# EAGLE design Grove  4-Digit Display V1.0 (EAGLE 6.1)
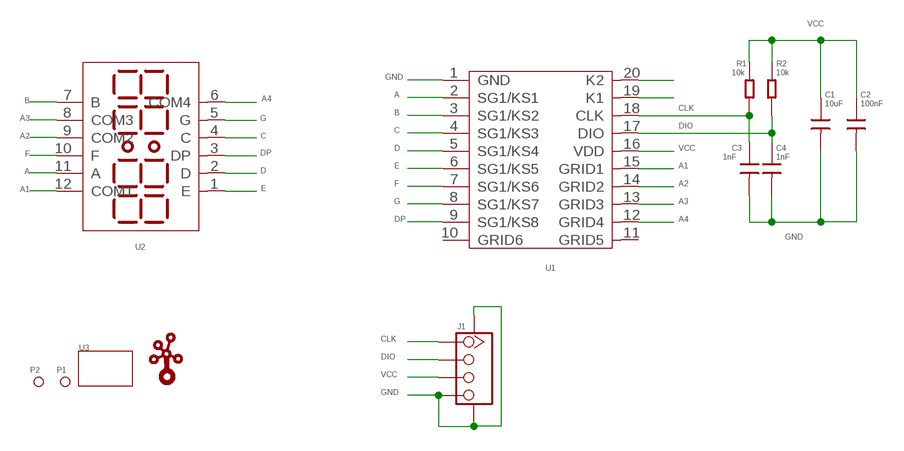
[diagram p0: schematic, sheet 1]

## Parts
C1  10uF  C-0603  [0603]
C2  100nF  C-0603  [0603]
C3  1nF  C-0603  [0603]
C4  1nF  C-0603  [0603]
J1  TWIG-4P-2.0-SMD-FEMALE-REINFORCE'90D'  [4P-SMD-2.0-90D]
P1  PAD-MARK  [ROUND-MARK-0.635]
P2  PAD-MARK  [ROUND-MARK-0.635]
R1  10k  R-0603  [0603]
R2  10k  R-0603  [0603]
U1  TM1637  [SOP20-10.45]
U2  LED-4-BETY-7-SEG  [7-4-BYTE-SEG-2.54-30X14X7.3H]
U3  TWIG-2U  [2U-DIM-W/-DRILL]
U$1  LOGO-TWIGTWIGLOGO_SMALL  [TWIGLOGO_SMALL]

## Nets
A: U1.2(SG1/KS1) U2.11(A)
A1: U1.15(GRID1) U2.12(COM1)
A2: U1.14(GRID2) U2.9(COM2)
A3: U1.13(GRID3) U2.8(COM3)
A4: U1.12(GRID4) U2.6(COM4)
B: U1.3(SG1/KS2) U2.7(B)
C: U1.4(SG1/KS3) U2.4(C)
CLK: C3.1 J1.1 R1.2 U1.18(CLK)
D: U1.5(SG1/KS4) U2.2(D)
DIO: C4.1 J1.2 R2.2 U1.17(DIO)
DP: U1.9(SG1/KS8) U2.3(DP)
E: U1.6(SG1/KS5) U2.1(E)
F: U1.7(SG1/KS6) U2.10(F)
G: U1.8(SG1/KS7) U2.5(G)
GND: C1.2 C2.2 C3.2 C4.2 J1.4 J1.SS1 J1.SS2 U1.1(GND)
N$17: U1.19(K1)
N$18: U1.20(K2)
VCC: C1.1 C2.1 J1.3 R1.1 R2.1 U1.16(VDD)
Unconnected: U1.10(GRID6) U1.11(GRID5)

## Library data of the parts
C1-C4 = Discrete:C*: Ceramic Capacitors
J1 = Connector:TWIG-4P-2.0-SMD-FEMALE-REINFORCE
P1 P2 = Discrete:PAD-MARK
R1 R2 = Discrete:R*
U1 = IC:TM1637
U2 = Module:LED-4-BETY-7-SEG
U3 = Module:TWIG
U$1 = Logo:LOGO-TWIG

## Board
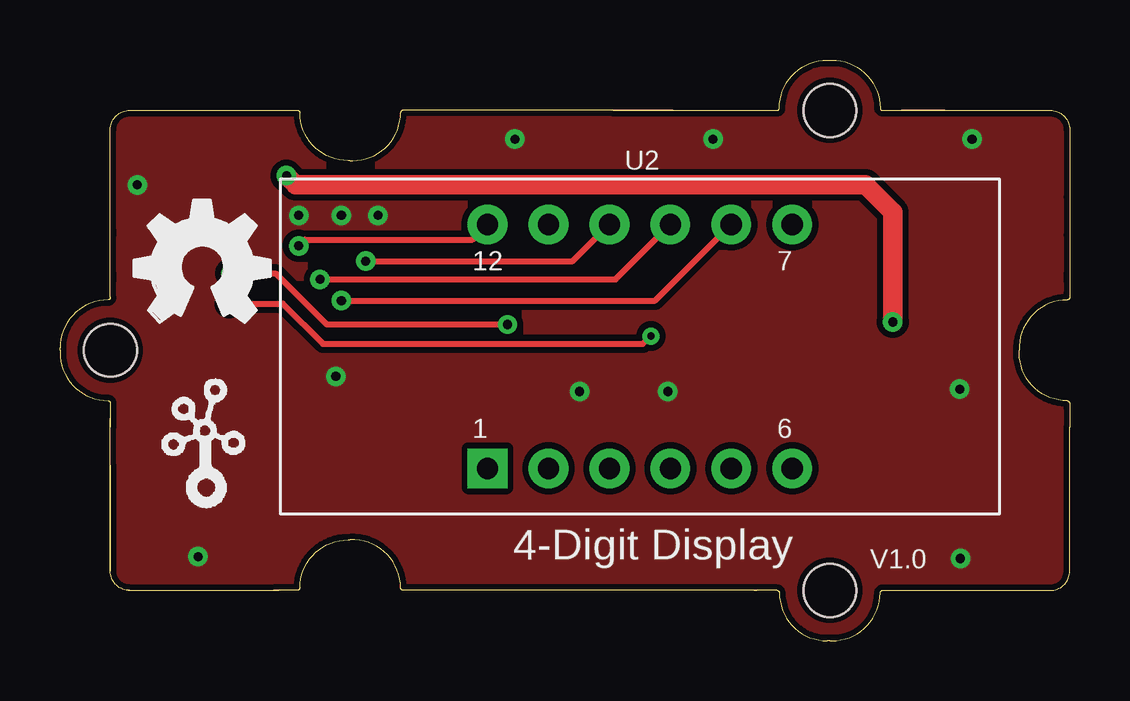
[diagram p1: board, top side]
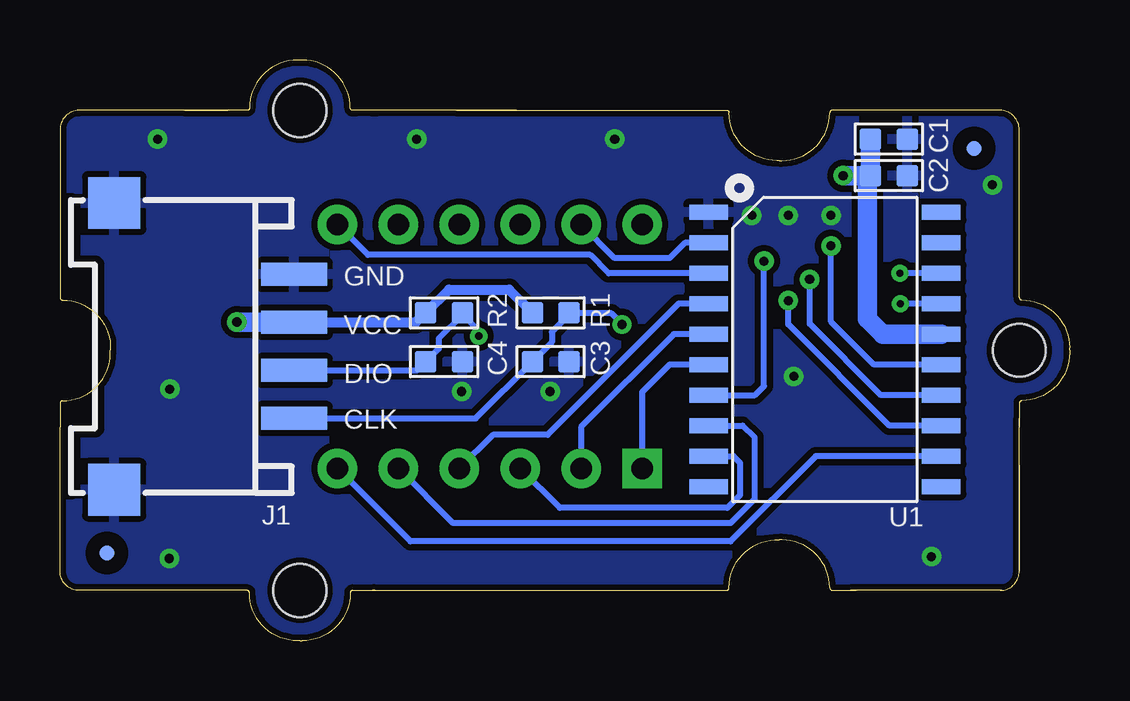
[diagram p2: board, bottom side, seen from below]

Size 42.09 x 24.2 mm. Coordinates in mm from the lower left corner, seen from the top.
Copper layers (1*16): Top 0.035mm / dielectric 1.5mm / Bottom 0.035mm
Design rules: minimum track width 10mil, minimum drill 12mil, track to track 8mil, track to pad 8mil, pad to pad 8mil, via to via 8mil, smd to smd 8mil, copper to edge 6mil, drill to drill 8mil, minimum pad ring 10mil, minimum via ring 8mil, stop-mask expansion 4mil, vias tented up to drill 100mil, thermal gap 10mil

### Footprints (pad centres in the part's own frame; a part is rotated, then mirrored left to right if it is on the bottom)
0603 = smd 0.889 x 0.889: 1 -0.762,0; 2 0.762,0
4P-SMD-2.0-90D = smd 0.965 x 2.74: 1 -3,-0.1; 2 -1,-0.1; 3 1,-0.1; 4 3,-0.1 | smd 2.159 x 2.184: SS1 -5.974,7.4; SS2 5.974,7.4
ROUND-MARK-0.635 = smd 0.635 x 0.635: P$1 0,0
SOP20-10.45 = smd 0.635 x 1.6: 1 -5.715,-4.85; 2 -4.445,-4.85; 3 -3.175,-4.85; 4 -1.905,-4.85; 5 -0.635,-4.85; 6 0.635,-4.85; 7 1.905,-4.85; 8 3.175,-4.85; 9 4.445,-4.85; 10 5.715,-4.85; 11 5.715,4.85; 12 4.445,4.85; 13 3.175,4.85; 14 1.905,4.85; 15 0.635,4.85; 16 -0.635,4.85; 17 -1.905,4.85; 18 -3.175,4.85; 19 -4.445,4.85; 20 -5.715,4.85
7-4-BYTE-SEG-2.54-30X14X7.3H = drill 0.889 pad 1.651 square: 1 -6.35,-5.08 | drill 0.889 pad 1.651: 2 -3.81,-5.08; 3 -1.27,-5.08; 4 1.27,-5.08; 5 3.81,-5.08; 6 6.35,-5.08; 7 6.35,5.08; 8 3.81,5.08; 9 1.27,5.08; 10 -1.27,5.08; 11 -3.81,5.08; 12 -6.35,5.08
2U-DIM-W/-DRILL = hole 2.2: 10.453,-10.42; 10.453,9.58; -19.535,-0.415

### Placement (x,y rotation side)
C1  7.54,20.9 0 bottom
C2  7.54,19.38 0 bottom
C3  21.64,11.63 0 bottom
C4  26.08,11.63 0 bottom
J1  32.43,12.27 90 bottom
P1  40.13,3.66 0 bottom
P2  3.98,20.52 0 bottom
R1  21.64,13.66 0 bottom
R2  26.08,13.66 0 bottom
U1  10.21,12.14 270 bottom
U2  24.18,12.27 0 top
U3  21.64,12.52 0 top
U$1  3.86,5.41 0 top
U$12  [OSHW_FILLX200_NOTEXT]  3.09,13.28 0 top

### Tracks (layer width: path | path; a pad name or v marks a point on that pad's centre or on a via)
A
  Bottom 0.254: U1.2 16.05,16.58 16.68,15.95 18.97,15.95 U2.11
A1  (via drill 0.38 pad 0.81)
  Top 0.254: v9.95,16.46 10.21,16.71 17.19,16.71 U2.12
  Bottom 0.254: U1.15 8.16,11.5 9.95,13.3 v9.95,16.46
A2  (via drill 0.38 pad 0.81)
  Top 0.254: v10.84,15.06 23.16,15.06 U2.9
  Bottom 0.254: U1.14 7.86,10.23 10.84,13.21 v10.84,15.06
A3  (via drill 0.38 pad 0.81)
  Top 0.254: v11.73,14.17 24.81,14.17 U2.8
  Bottom 0.254: U1.13 7.51,8.96 11.73,13.19 v11.73,14.17
A4
  Bottom 0.254: U1.12 10.59,7.69 14.14,4.14 27.48,4.14 U2.6
B
  Bottom 0.254: U1.3 19.22,15.31 19.98,16.08 29.26,16.08 U2.7
C
  Bottom 0.254: U1.4 16.3,14.04 21.76,8.58 24.05,8.58 U2.4
CLK  (via drill 0.3 pad 0.64, 0.38 pad 0.3)
  Top 0.254: v7.08,15.31 8.99,15.31 11.12,13.18 v18.66,13.18
  Bottom 0.254: 20.87,13.64 20.87,13.59 21.58,12.88 21.58,12.44 C3.1 24.76,9.27 J1.1 | U1.18 v7.08,15.31 | v18.66,13.18 18.66,13.21 19.1,13.64 20.87,13.64 | 20.87,13.64 20.92,13.69 | 20.87,13.64 R1.2
D
  Bottom 0.254: U1.5 16.5,12.77 20.37,8.91 U2.2
DIO  (via drill 0.3 pad 0.64)
  Top 0.254: v7.06,14.04 9.29,14.04 10.97,12.37 24.3,12.37 v24.63,12.7
  Bottom 0.254: J1.2 27.21,11.27 C4.1 26.31,12.16 26.31,12.6 25.32,13.59 25.32,13.61 | R2.2 25.32,13.61 | U1.17 v7.06,14.04 | v24.63,12.7 24.63,12.93 25.32,13.61
DP
  Bottom 0.254: U1.9 14.02,7.69 13.74,7.42 13.74,6.07 14.27,5.53 21.25,5.53 U2.3
E
  Bottom 0.254: U1.6 16.68,11.5 17.83,10.36 U2.1 17.83,7.06
F  (via drill 0.38 pad 0.81)
  Top 0.254: v12.75,15.81 21.37,15.81 U2.10 | v12.75,15.81 12.75,15.7 | v12.75,15.82 v12.75,15.81
  Bottom 0.254: v12.75,15.82 12.75,10.62 13.13,10.23 U1.7
G
  Bottom 0.254: U1.8 13.63,8.96 13.14,8.47 13.14,5.9 14.14,4.9 25.7,4.9 U2.5
GND  (via drill 0.38 pad 0.81)
  other vias: 37.51,10.49 13.25,17.73 3.22,19 5.76,3.5 37.54,3.43 11.73,17.73 9.95,17.73 25.34,10.39 21.66,10.39 18.97,20.9 27.22,20.9 38.02,20.9 11.5,11.02
  pour Bottom (isolate 0.254): -0.59,24.59 42.59,24.59 42.59,-0.82 -0.59,-0.82
  pour Top (isolate 0.254): -0.59,24.59 42.59,24.59 42.59,-0.82 -0.59,-0.82
VCC  (via drill 0.38 pad 0.81)
  Top 0.813: v34.72,13.28 34.72,17.85 33.57,19 9.82,19 v9.44,19.38
  Bottom 0.406: J1.3 27.26,13.27 26.87,13.66 R2.1 25.88,14.63 23.36,14.63 R1.1
  Bottom 0.813: U1.16 7.79,12.77 8.43,13.41 8.43,19.25 C2.1 | C2.1 C1.1 | C2.1 v9.44,19.38 | v34.72,13.28 32.35,13.28 J1.3

### Text on the board
tPlace: 4-Digit Display | V1.0
bPlace: GND | VCC | DIO | CLK